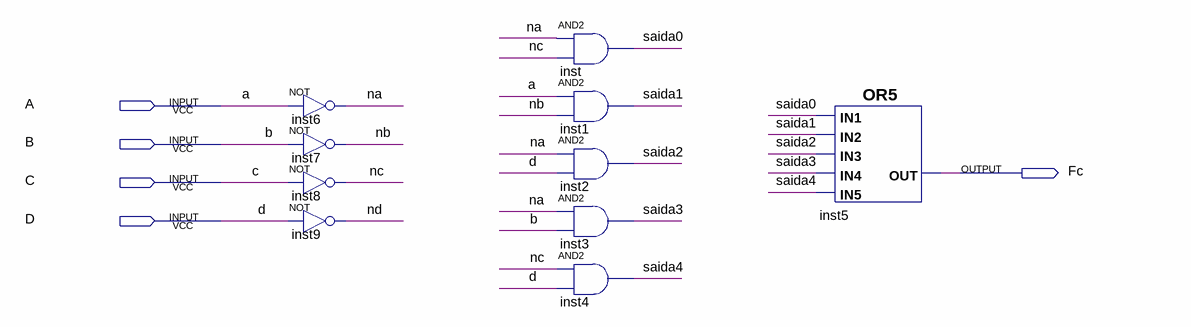
[diagram p0: schematic sheet]
// Quartus schematic FuncaoC.bdf as structural Verilog: 10 symbols, 5 pins
module FuncaoC (
  input  A,
  input  B,
  input  C,
  input  D,
  output Fc
);

  wire na, nb, nc, nd, saida0, saida1, saida2, saida3, saida4;

  not inst6 (na, A);
  not inst7 (nb, B);
  not inst8 (nc, C);
  not inst9 (nd, D);
  and inst (saida0, na, nc);
  and inst1 (saida1, A, nb);
  and inst2 (saida2, na, D);
  and inst3 (saida3, na, B);
  and inst4 (saida4, nc, D);
  or inst5 (Fc, saida0, saida1, saida2, saida3, saida4);
endmodule
